# Altium project pca63519.PrjPCB
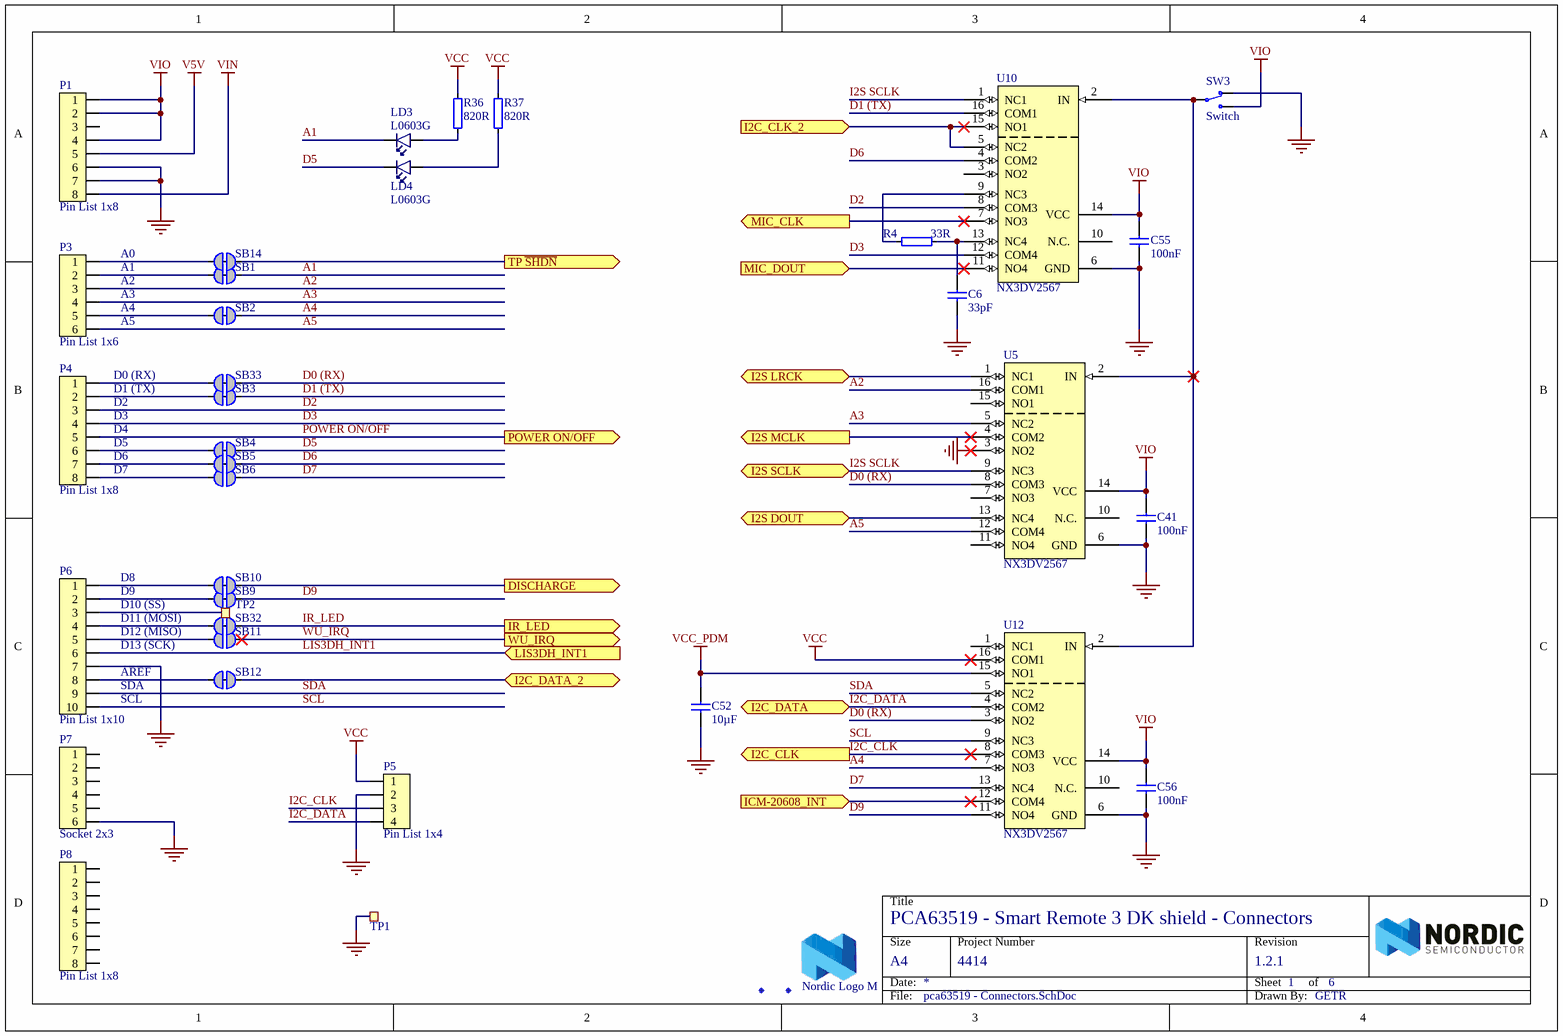
[diagram p0: pca63519 - Connectors.SchDoc]
3 sheets, 120 parts. Net scope: flat (ports and power ports of the same name join across sheets).
Board file: 400129.PcbDoc
Sheets:
  pca63519 - Connectors.SchDoc
  pca63519 - Keyboard.SchDoc
  pca63519 - TouchPad.SchDoc

## Sheet pca63519 - Connectors.SchDoc: PCA63519 - Smart Remote 3 DK shield - Connectors
size A4; DocumentNumber: 1; Revision: 1.2.1; SheetNumber: 1; SheetTotal: 6; DrawnBy: GETR; ProjectNumber: 4414; DocumentSize: A4; PCBRevision: 0049GETR; PCAName: PCA63519; PCBNumber: 400129

### Parts
C6  33pF  [CAPC1005X04L]
C41  100nF  [CAPC1005X04L]
C52  10µF  [CAPC1005X04L]
C55  100nF  [CAPC1005X04L]
C56  100nF  [CAPC1005X04L]
Fid1  Fiducial mark  [Fiducial]  (value not drawn)
Fid2  Fiducial mark  [Fiducial]  (value not drawn)
LD3  L0603G  [LED_0603_G]
LD4  L0603G  [LED_0603_G]
LOGO1  Nordic Logo M  [NORDIC_LOGO_M]  (no BOM)
P1  Pin List 1x8  [LIST_1x8_SMD]
P3  Pin List 1x6  [LIST_1x6_SMD]
P4  Pin List 1x8  [LIST_1x8_SMD]
P5  Pin List 1x4  [LIST_1x4]
P6  Pin List 1x10  [LIST_1x10_SMD]
P7  Socket 2x3  [SOCKET_2x3_SMD-2.54mm-bottom]
P8  Pin List 1x8  [LIST_1x8_SMD]
R4  33R  [RESC1005X04L]
R36  820R  [RESC1005X04L]
R37  820R  [RESC1005X04L]
SB1  Solderbridge  [Solderbridge_SHORTED_0.4]  (value not drawn)  (net tie, no BOM)
SB2  Solderbridge  [Solderbridge_SHORTED_0.4]  (value not drawn)  (net tie, no BOM)
SB3  Solderbridge  [Solderbridge_SHORTED_0.4]  (value not drawn)  (net tie, no BOM)
SB4  Solderbridge  [Solderbridge_SHORTED_0.4]  (value not drawn)  (net tie, no BOM)
SB5  Solderbridge  [Solderbridge_SHORTED_0.4]  (value not drawn)  (net tie, no BOM)
SB6  Solderbridge  [Solderbridge_0.4]  (value not drawn)  (no BOM)
SB9  Solderbridge  [Solderbridge_SHORTED_0.4]  (value not drawn)  (net tie, no BOM)
SB10  Solderbridge  [Solderbridge_SHORTED_0.4]  (value not drawn)  (net tie, no BOM)
SB11  Solderbridge  [Solderbridge_0.4]  (value not drawn)  (no BOM)
SB12  Solderbridge  [Solderbridge_SHORTED_0.4]  (value not drawn)  (net tie, no BOM)
SB14  Solderbridge  [Solderbridge_SHORTED_0.4]  (value not drawn)  (net tie, no BOM)
SB32  Solderbridge  [Solderbridge_SHORTED_0.4]  (value not drawn)  (net tie, no BOM)
SB33  Solderbridge  [Solderbridge_SHORTED_0.4]  (value not drawn)  (net tie, no BOM)
SW3  Switch  [CJS-120xA]
TP1  Ø1.0mm,SMD  [TP_SMD_Ø1.0mm]  (value not drawn)  (no BOM)
TP2  Ø1.0mm,SMD  [TP_SMD_Ø1.0mm]  (value not drawn)  (no BOM)
U5  NX3DV2567  [XQFN40P180X260X50-16N]
U10  NX3DV2567  [XQFN40P180X260X50-16N]
U12  NX3DV2567  [XQFN40P180X260X50-16N]

### Ports
DISCHARGE (out), I2C_CLK (out), I2C_CLK_2 (in), I2C_DATA (bidir), I2C_DATA_2 (bidir), I2S DOUT (bidir), I2S LRCK (bidir), I2S MCLK (out), I2S SCLK (bidir), ICM-20608_INT (in), IR_LED (out), LIS3DH_INT1 (in), MIC_CLK (out), MIC_DOUT (in), POWER ON/OFF (out), TP ~{SHDN} (out), WU_IRQ (out)

### Nets
GND: C6.1 C41.1 C52.1 C55.1 C56.1 P1.6 P1.7 P5.2 P6.7 P7.6 SW3.1(N.C) TP1.1 U5.3(NO2) U5.6(GND) U10.6(GND) U12.6(GND)
V5V: P1.5
VCC: P5.1 R36.2 R37.2 U12.16(COM1)
VCC_PDM: C52.2 U12.15(NO1)
VIN: P1.8
VIO: C41.2 C55.2 C56.2 P1.1 P1.2 P1.4 SW3.3(N.O) U5.14(VCC) U10.14(VCC) U12.14(VCC)
A1: LD3.1(C) SB1.1
A2: P3.3 U5.16(COM1)
A3: P3.4 U5.5(NC2)
A4: SB2.1 U12.7(NO3)
A5: P3.6 U5.12(COM4)
D0 (RX): SB33.1 U5.8(COM3) U12.3(NO2)
D1 (TX): SB3.1 U10.16(COM1)
D2: P4.3 U10.8(COM3)
D3: P4.4 U10.12(COM4)
D5: LD4.1(C) SB4.1
D6: SB5.1 U10.4(COM2)
D7: SB6.1 U12.13(NC4)
D9: SB9.1 U12.11(NO4)
I2C_CLK: P5.3 U12.8(COM3) ; port I2C_CLK
I2C_DATA: P5.4 U12.4(COM2) ; port I2C_DATA
I2S SCLK: U5.9(NC3) U10.1(NC1) ; port I2S SCLK
IR_LED: SB32.1 ; port IR_LED
LIS3DH_INT1: P6.6 ; port LIS3DH_INT1
POWER ON/OFF: P4.5 ; port POWER ON/OFF
SCL: P6.10 U12.9(NC3)
SDA: P6.9 U12.5(NC2)
WU_IRQ: SB11.1 ; port WU_IRQ
NetC6_2: C6.2 R4.2 U10.13(NC4)
NetLD3_2: LD3.2(A) R36.1
NetLD4_2: LD4.2(A) R37.1
NetP3_1: P3.1 SB14.2
NetP3_2: P3.2 SB1.2
NetP3_5: P3.5 SB2.2
NetP4_1: P4.1 SB33.2
NetP4_2: P4.2 SB3.2
NetP4_6: P4.6 SB4.2
NetP4_7: P4.7 SB5.2
NetP4_8: P4.8 SB6.2
NetP6_1: P6.1 SB10.2
NetP6_2: P6.2 SB9.2
NetP6_3: P6.3 TP2.1
NetP6_4: P6.4 SB32.2
NetP6_5: P6.5 SB11.2
NetP6_8: P6.8 SB12.2
NetQ1_1: SB10.1 ; port DISCHARGE
NetR4_1: R4.1 U10.9(NC3)
NetR25_1: SB14.1 ; port TP ~{SHDN}
NetSB12_1: SB12.1 ; port I2C_DATA_2
NetSW3_2: SW3.2(COM) U5.2(IN) U10.2(IN) U12.2(IN)
NetU5_1: U5.1(NC1) ; port I2S LRCK
NetU5_4: U5.4(COM2) ; port I2S MCLK
NetU5_13: U5.13(NC4) ; port I2S DOUT
NetU10_5: U10.5(NC2) U10.15(NO1) ; port I2C_CLK_2
NetU10_7: U10.7(NO3) ; port MIC_CLK
NetU10_11: U10.11(NO4) ; port MIC_DOUT
NetU12_12: U12.12(COM4) ; port ICM-20608_INT

Not connected (* = marked no-connect by the designer): P1 3; P7 1 2 3 4 5; P8 1 2 3 4 5 6 7 8; U5 7(NO3) 10(N.C.) 11(NO4) 15(NO1); U10 3(NO2) 10(N.C.); U12 1(NC1) 10(N.C.)

### Notes on the sheet
- (near P3) A0
- (near P3) A1
- (near P3) A2
- (near P3) A3
- (near P3) A4
- (near P4) D0 (RX)
- (near P3) A5
- (near P4) D1 (TX)
- (near P4) D2
- (near P4) D3
- (near P4) D4
- (near P4) D5
- (near P4) D6
- (near P4) D7
- (near P6) D8
- (near P6) D9
- D10 (SS)
- D11 (MOSI)
- D12 (MISO)
- D13 (SCK)
- (near P6) AREF
- (near P6) SDA
- (near P6) SCL
- Title
- Size
- Date:
- Project Number
- Sheet         of
- Revision
- File:
- Drawn By:

### Library data of the parts
C6 = C0402-33p: Capacitor, NP0, ±5%; Note: 50V; Artikkelnr Noca: 20029146; Artikkelnr Simpro: N.A.; Part Number: C0402-33p; Manufacturer: *; Manufacturer Part Number: *; Datasheet: *; Footprint Doc: 0402; LatestRevisionDate: 2009-05-08; Pin Count: 2; Publisher: Nordic Semiconductor; Published: 2009-05-08; Value: 33pF; Supplier: *; Supplier part number: *; 2nd source Supplier: *; 2nd source part number: *
C41 C55 C56 = C0402-100n: Capacitor, X7R, ±10%; Note: 16V; Artikkelnr Noca: 20039200; Artikkelnr Simpro: N.A.; Part Number: C0402-100n; Manufacturer: *; Manufacturer Part Number: *; Datasheet: *; Footprint Doc: 0402; LatestRevisionDate: 2009-11-23; Pin Count: 2; Publisher: Nordic Semiconductor; Published: 2009-05-08; Value: 100nF; Supplier: *; Supplier part number: *; 2nd source Supplier: *; 2nd source part number: *
C52 = C0402-10µF: 10µF ±20% 10V X5R Ceramic Capacitor -55°C ~ 85°C Surface Mount, MLCC 0402; Manufacturer: Samsung; Manufacturer Part Number: CL05A106MP5NUNC; Artikkelnr Noca: N.A.; Part Number: C0402-10µF; Datasheet: http://www.samsungsem.com/kr/support/product-search/mlcc/CL05A106MP5NUNC.jsp; Footprint Doc: 0402; LatestRevisionDate: 2016-04-19; Pin Count: 2; Publisher: Nordic Semiconductor; Published: 2011-01-17; Value: 10µF; Note: 10V; Supplier: Digi-Key; Supplier part number: 1276-1450-1-ND; 2nd source Supplier: *; 2nd source part number: *; Artikkelnr Simpro: N.A.
Fid1 Fid2 = Fid-Mark: Artikkelnr Noca: N.A.; Part Number: Fid-Mark; Manufacturer: *; Manufacturer Part Number: *; Datasheet: *; LatestRevisionDate: 2009-12-12; Pin Count: 1; Publisher: Nordic Semiconductor; Published: 2009-12-12; Value: *; Note: *; Supplier: *; Supplier part number: *; 2nd source Supplier: *; 2nd source part number: *; Footprint Doc: Fiducial; Artikkelnr Simpro: N.A.
LD3 LD4 = LG L29K Smartled Green: LED SMARTLED GREEN 570NM 0603; Manufacturer: Osram; Manufacturer Part Number: LG L29K-G2J1-24-Z; 2nd source part number: 720-LGL29KG2J124Z; Note: 2,24..5.6 mcd, Vfmin=1.7V; Artikkelnr Noca: 13019147; Artikkelnr Simpro: N.A.; Part Number: LG L29K Smartled Green; Datasheet: http://www.osram-os.com/Graphics/XPic2/00077107_0.pdf; Footprint Doc: 0603; LatestRevisionDate: 2016-08-26; Pin Count: 2; Publisher: Nordic Semiconductor; Published: 2014-10-28; Value: L0603G; Supplier: Digi-Key; Supplier part number: 475-2709-1-ND; 2nd source Supplier: Mouser
LOGO1 = Nordic Logo M: Nordic Logo, medium size; Artikkelnr Noca: N.A.; Part Number: Nordic Logo M; Manufacturer: *; Manufacturer Part Number: *; Datasheet: *; LatestRevisionDate: 2010-02-18; Publisher: Nordic Semiconductor; Value: Nordic Logo M; Note: *; Supplier: *; Supplier part number: *; 2nd source Supplier: *; 2nd source part number: *; Pin Count: 2; Published: 2010-02-18; Footprint Doc: NORDIC_LOGO_M; Artikkelnr Simpro: N.A.
P1 P4 P8 = Pin List 1x8 SMD: Pin List 1x8, 2.54mm (100mil), SMD; Manufacturer: W-CON; Manufacturer Part Number: 1125-1108S0M116R2; 2nd source part number: TSM-108-01-L-SV-P-TR; Artikkelnr Noca: 55010006; Artikkelnr Simpro: N.A.; Part Number: Pin List 1x8 SMD; Datasheet: \\hizz\pro\app9717\Datasheet\connectores\W-CON\1125-11XXXXMXXXXX.pdf; LatestRevisionDate: 2016-01-22; Publisher: Nordic Semiconductor; Published: 2016-01-22; Value: Pin List 1x8; Note: *; Supplier: Cabcon; Supplier part number: 1125-1108S0M116R2; 2nd source Supplier: Samtec; Pin Count: 8; Footprint Doc: LIST_1x8_SMD
P3 = Pin List 1x6 SMD: Pin List 1x6, 2.54mm (100mil), SMD; Manufacturer: W-CON; Manufacturer Part Number: 1125-1106S0M116R2; 2nd source part number: TSM-106-01-L-SV-P-TR; Artikkelnr Noca: 55010026; Artikkelnr Simpro: N.A.; Part Number: Pin List 1x6 SMD; Datasheet: \\hizz\pro\app9717\Datasheet\connectores\W-CON\1125-11XXXXMXXXXX.pdf; LatestRevisionDate: 2016-03-29; Pin Count: 6; Publisher: Nordic Semiconductor; Published: 2016-03-29; Value: Pin List 1x6; Note: *; Supplier: Cabcon; Supplier part number: 1125-1106S0M116R2; 2nd source Supplier: Samtec; Footprint Doc: LIST_1x6_SMD
P5 = Pin List 1x4: Pin List 1x4, 2.54mm (100mil); Artikkelnr Noca: 56019092; Artikkelnr Simpro: N.A.; Part Number: Pin List 1x4; Manufacturer: *; Manufacturer Part Number: *; Datasheet: *; Footprint Doc: LIST_1x4; LatestRevisionDate: 2009-12-12; Pin Count: 4; Publisher: Nordic Semiconductor; Published: 2009-12-12; Value: Pin List 1x4; Note: *; Supplier: *; Supplier part number: *; 2nd source Supplier: *; 2nd source part number: *
P6 = Pin List 1x10 SMD: Pin List 1x10, 2.54mm (100mil), SMD; Manufacturer: W-CON; Manufacturer Part Number: 1125-1110S0M116R2; 2nd source part number: TSM-110-01-L-SV-P-TR; Artikkelnr Noca: 55010028; Artikkelnr Simpro: N.A.; Part Number: Pin List 1x10 SMD; Datasheet: \\hizz\pro\app9717\Datasheet\connectores\W-CON\1125-11XXXXMXXXXX.pdf; LatestRevisionDate: 2016-03-29; Publisher: Nordic Semiconductor; Published: 2016-03-29; Value: Pin List 1x10; Note: *; Supplier: Cabcon; Supplier part number: 1125-1110S0M116R2; 2nd source Supplier: Samtec; Pin Count: 10; Footprint Doc: LIST_1x10_SMD
P7 = Socket 2x3 SMD Bottom: Socket 2x3, 2.54mm (100mil), SMD; Manufacturer: W-CON; Manufacturer Part Number: 2171-203MS0CUNR1; 2nd source part number: SSM-103-F-DV-P-TR; Artikkelnr Noca: 55030010; Artikkelnr Simpro: N.A.; Part Number: Socket 2x3 SMD Bottom; Datasheet: \\hizz\pro\app9717\Datasheet\connectores\W-CON\2171-2XXMXXCUNXX.pdf; LatestRevisionDate: 2016-03-29; Pin Count: 6; Publisher: Nordic Semiconductor; Published: 2014-06-10; Value: Socket 2x3; Note: *; Supplier: Cabcon; Supplier part number: 2171-203MS0CUNR1; 2nd source Supplier: Samtec; Footprint Doc: SOCKET_2x3_SMD-2.54mm-bottom
R4 = R0402-33R: Resistor, ±1%, 0.063W; Note: Chip Res 1%; Artikkelnr Noca: 27049037; Artikkelnr Simpro: N.A.; Value Ohm: 33; Part Number: R0402-33R; Manufacturer: *; Manufacturer Part Number: *; Datasheet: *; Footprint Doc: 0402; LatestRevisionDate: 2009-11-23; Pin Count: 2; Publisher: Nordic Semiconductor; Published: 2009-05-08; Value: 33R; Supplier: Farnell; Supplier part number: 173-8830; 2nd source Supplier: *; 2nd source part number: *
R36 R37 = R0402-820: Resistor, ±1%, 0.063W; Note: Chip Res 1%; Artikkelnr Noca: 27049071; Artikkelnr Simpro: N.A.; Value Ohm: 820; Part Number: R0402-820; Manufacturer: *; Manufacturer Part Number: *; Datasheet: *; Footprint Doc: 0402; LatestRevisionDate: 2009-11-23; Pin Count: 2; Publisher: Nordic Semiconductor; Published: 2009-05-08; Value: 820R; Supplier: Farnell; Supplier part number: 173-8849; 2nd source Supplier: *; 2nd source part number: *
SB1-SB5 SB9 SB10 SB12 SB14 SB32 SB33 = Solderbridge Shorted 0.4mm: Shorted Solderbridge; Artikkelnr Noca: N.A.; Part Number: Solderbridge Shorted 0.4mm; Manufacturer: *; Manufacturer Part Number: *; Datasheet: *; Footprint Doc: Solderbridge_Shorted; LatestRevisionDate: 2012-08-07; Pin Count: 2; Publisher: Nordic Semiconductor; Published: 2012-08-07; Value: Solderbridge; Note: *; Supplier: *; Supplier part number: *; 2nd source Supplier: *; 2nd source part number: *; Artikkelnr Simpro: N.A.
SB6 SB11 = Solderbridge 0.4mm: Artikkelnr Noca: N.A.; Part Number: Solderbridge 0.4mm; Manufacturer: *; Manufacturer Part Number: *; Datasheet: *; Footprint Doc: Solderbridge; LatestRevisionDate: 2009-12-14; Pin Count: 2; Publisher: Nordic Semiconductor; Published: 2009-12-14; Value: Solderbridge; Note: *; Supplier: *; Supplier part number: *; 2nd source Supplier: *; 2nd source part number: *; Artikkelnr Simpro: N.A.
SW3 = CJS-1200TA: SMD slide Switch (ON-ON); Manufacturer: Copal Electronics Inc; Artikkelnr Noca: 50019068; Artikkelnr Simpro: N.A.; Part Number: CJS-1200TA; Manufacturer Part Number: CJS-1200TA; Datasheet: http://media.digikey.com/pdf/Data%20Sheets/COPAL%20Electronics%20PDFs/CJS.pdf; LatestRevisionDate: 2012-10-03; Pin Count: 3; Publisher: Nordic Semiconductor; Published: 2012-10-03; Value: Switch; Note: *; Supplier: Digi-Key; Supplier part number: 563-1021-2-ND; 2nd source Supplier: *; 2nd source part number: *; Footprint Doc: CJS-120xA
TP1 TP2 = TP_SMD_Ø1.0MM: 1.0mm circular SMD testpad; Manufacturer: Nordic Semiconductor; Artikkelnr Noca: N.A.; Part Number: TP_SMD_Ø1.0MM; Manufacturer Part Number: *; Datasheet: *; Footprint Doc: TP_SMD_Ø1.0mm; LatestRevisionDate: 2013-06-11; Pin Count: 1; Publisher: Nordic Semiconductor; Published: 2013-06-11; Value: Ø1.0mm,SMD; Note: *; Supplier: *; Supplier part number: *; 2nd source Supplier: *; 2nd source part number: *; Artikkelnr Simpro: N.A.
U5 U10 U12 = NX3DV2567GU: Low-ohmic four-pole double-throw analog switch; Manufacturer: NXP Semiconductors; 2nd source part number: 771-NX3DV2567GU115; Artikkelnr Noca: 15079317; Artikkelnr Simpro: N.A.; Part Number: NX3DV2567GU; Manufacturer Part Number: NX3DV2567GU; Datasheet: http://www.nxp.com/documents/data_sheet/NX3DV2567.pdf; Footprint Doc: XQFN-16; LatestRevisionDate: 2015-02-17; Pin Count: 16; Publisher: Nordic Semiconductor; Published: 2015-02-17; Value: NX3DV2567; Note: *; Supplier: Digi-Key; Supplier part number: 568-5206-1-ND; 2nd source Supplier: Mouser

## Sheet pca63519 - Keyboard.SchDoc: PCA63519 - Smart Remote 3 DK shield - Keyboard
size A4; DocumentNumber: 4; Revision: 1.2.1; SheetNumber: 4; SheetTotal: 6; DrawnBy: GETR; ProjectNumber: 4414; DocumentSize: A4; PCBRevision: 0049GETR; PCAName: PCA63519; PCBNumber: 400129
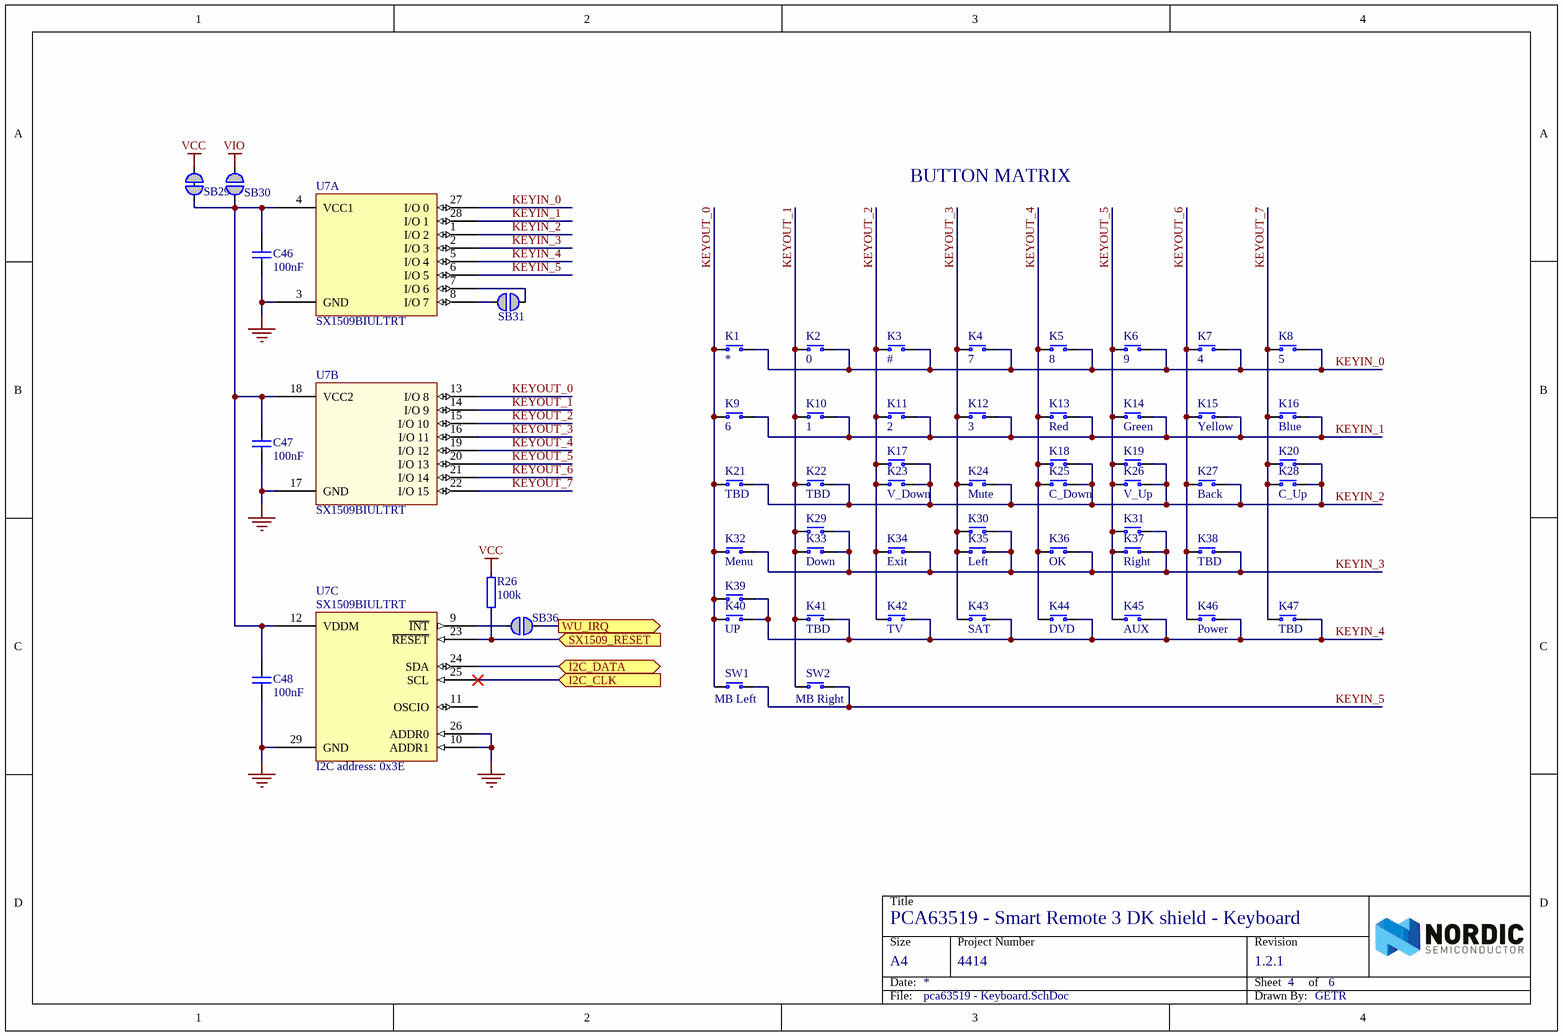
[diagram p1: pca63519 - Keyboard.SchDoc]

### Parts
C46  100nF  [CAPC1005X04L]
C47  100nF  [CAPC1005X04L]
C48  100nF  [CAPC1005X04L]
K1  *  [PCB Switch]  (no BOM)
K2  0  [PCB Switch]  (no BOM)
K3  #  [PCB Switch]  (no BOM)
K4  7  [PCB Switch]  (no BOM)
K5  8  [PCB Switch]  (no BOM)
K6  9  [PCB Switch]  (no BOM)
K7  4  [PCB Switch]  (no BOM)
K8  5  [PCB Switch]  (no BOM)
K9  6  [PCB Switch]  (no BOM)
K10  1  [PCB Switch]  (no BOM)
K11  2  [PCB Switch]  (no BOM)
K12  3  [PCB Switch]  (no BOM)
K13  Red  [PCB Switch]  (no BOM)
K14  Green  [PCB Switch]  (no BOM)
K15  Yellow  [PCB Switch]  (no BOM)
K16  Blue  [PCB Switch]  (no BOM)
K17  PCB SW  [PCB Switch]  (value not drawn)  (no BOM)
K18  PCB SW  [PCB Switch]  (value not drawn)  (no BOM)
K19  PCB SW  [PCB Switch]  (value not drawn)  (no BOM)
K20  PCB SW  [PCB Switch]  (value not drawn)  (no BOM)
K21  TBD  [PCB Switch]  (no BOM)
K22  TBD  [PCB Switch]  (no BOM)
K23  V_Down  [PCB Switch]  (no BOM)
K24  Mute  [PCB Switch]  (no BOM)
K25  C_Down  [PCB Switch]  (no BOM)
K26  V_Up  [PCB Switch]  (no BOM)
K27  Back  [PCB Switch]  (no BOM)
K28  C_Up  [PCB Switch]  (no BOM)
K29  PCB SW  [PCB Switch]  (value not drawn)  (no BOM)
K30  PCB SW  [PCB Switch]  (value not drawn)  (no BOM)
K31  PCB SW  [PCB Switch]  (value not drawn)  (no BOM)
K32  Menu  [PCB Switch]  (no BOM)
K33  Down  [PCB Switch]  (no BOM)
K34  Exit  [PCB Switch]  (no BOM)
K35  Left  [PCB Switch]  (no BOM)
K36  OK  [PCB Switch]  (no BOM)
K37  Right  [PCB Switch]  (no BOM)
K38  TBD  [PCB Switch]  (no BOM)
K39  PCB SW  [PCB Switch]  (value not drawn)  (no BOM)
K40  UP  [PCB Switch]  (no BOM)
K41  TBD  [PCB Switch]  (no BOM)
K42  TV  [PCB Switch]  (no BOM)
K43  SAT  [PCB Switch]  (no BOM)
K44  DVD  [PCB Switch]  (no BOM)
K45  AUX  [PCB Switch]  (no BOM)
K46  Power  [PCB Switch]  (no BOM)
K47  TBD  [PCB Switch]  (no BOM)
R26  100k  [RESC1005X04L]
SB29  Solderbridge  [Solderbridge_SHORTED_0.4]  (value not drawn)  (net tie, no BOM)
SB30  Solderbridge  [Solderbridge_0.4]  (value not drawn)  (no BOM)
SB31  Solderbridge  [Solderbridge_0.4]  (value not drawn)  (no BOM)
SB36  Solderbridge  [Solderbridge_0.4]  (value not drawn)  (no BOM)
SW1  MB Left  [ALPS_SKHUxxx010_WO_GND]
SW2  MB Right  [ALPS_SKHUxxx010_WO_GND]
U7  SX1509BIULTRT  [QFN40P400X400X60_HS-29N]  (parts A,B,C of 3)

### Ports
I2C_CLK (in), I2C_DATA (bidir), SX1509_RESET (in), WU_IRQ (out)

### Nets
GND: C46.1 C47.1 C48.1 U7.3(GND) U7.10(ADDR1) U7.17(GND) U7.26(ADDR0) U7.29(GND)
VCC: R26.2 SB29.1
VIO: SB30.1
I2C_CLK: U7.25(SCL) ; port I2C_CLK
I2C_DATA: U7.24(SDA) ; port I2C_DATA
KEYIN_0: K1.1(N.O) K2.1(N.O) K3.1(N.O) K4.1(N.O) K5.1(N.O) K6.1(N.O) K7.1(N.O) K8.1(N.O) U7.27(I/O_0)
KEYIN_1: K9.1(N.O) K10.1(N.O) K11.1(N.O) K12.1(N.O) K13.1(N.O) K14.1(N.O) K15.1(N.O) K16.1(N.O) U7.28(I/O_1)
KEYIN_2: K17.1(N.O) K18.1(N.O) K19.1(N.O) K20.1(N.O) K21.1(N.O) K22.1(N.O) K23.1(N.O) K24.1(N.O) K25.1(N.O) K26.1(N.O) K27.1(N.O) K28.1(N.O) U7.1(I/O_2)
KEYIN_3: K29.1(N.O) K30.1(N.O) K31.1(N.O) K32.1(N.O) K33.1(N.O) K34.1(N.O) K35.1(N.O) K36.1(N.O) K37.1(N.O) K38.1(N.O) U7.2(I/O_3)
KEYIN_4: K39.1(N.O) K40.1(N.O) K41.1(N.O) K42.1(N.O) K43.1(N.O) K44.1(N.O) K45.1(N.O) K46.1(N.O) K47.1(N.O) U7.5(I/O_4)
KEYIN_5: SW1.1(N.O) SW2.1(N.O) U7.6(I/O_5)
KEYOUT_0: K1.2(COM) K9.2(COM) K21.2(COM) K32.2(COM) K39.2(COM) K40.2(COM) SW1.2(COM) U7.13(I/O_8)
KEYOUT_1: K2.2(COM) K10.2(COM) K22.2(COM) K29.2(COM) K33.2(COM) K41.2(COM) SW2.2(COM) U7.14(I/O_9)
KEYOUT_2: K3.2(COM) K11.2(COM) K17.2(COM) K23.2(COM) K34.2(COM) K42.2(COM) U7.15(I/O_10)
KEYOUT_3: K4.2(COM) K12.2(COM) K24.2(COM) K30.2(COM) K35.2(COM) K43.2(COM) U7.16(I/O_11)
KEYOUT_4: K5.2(COM) K13.2(COM) K18.2(COM) K25.2(COM) K36.2(COM) K44.2(COM) U7.19(I/O_12)
KEYOUT_5: K6.2(COM) K14.2(COM) K19.2(COM) K26.2(COM) K31.2(COM) K37.2(COM) K45.2(COM) U7.20(I/O_13)
KEYOUT_6: K7.2(COM) K15.2(COM) K27.2(COM) K38.2(COM) K46.2(COM) U7.21(I/O_14)
KEYOUT_7: K8.2(COM) K16.2(COM) K20.2(COM) K28.2(COM) K47.2(COM) U7.22(I/O_15)
WU_IRQ: SB36.1 ; port WU_IRQ
NetC46_2: C46.2 C47.2 C48.2 SB29.2 SB30.2 U7.4(VCC1) U7.12(VDDM) U7.18(VCC2)
NetR26_1: R26.1 U7.23(~{RESET}) ; port SX1509_RESET
NetSB31_1: SB31.1 U7.8(I/O_7)
NetSB31_2: SB31.2 U7.7(I/O_6)
NetSB36_2: SB36.2 U7.9(~{INT})

Not connected (* = marked no-connect by the designer): U7 11(OSCIO)

### Notes on the sheet
- BUTTON MATRIX
- (near U7) I2C address: 0x3E
- Title
- Size
- Date:
- Project Number
- Sheet         of
- Revision
- File:
- Drawn By:

### Library data of the parts
C46-C48 = C0402-100n: as C41 on sheet pca63519 - Connectors; Part Number: C0402-100n; Manufacturer: *; Manufacturer Part Number: *; Datasheet: *; LatestRevisionDate: 2009-11-23; Pin Count: 2; Publisher: Nordic Semiconductor; Published: 2009-05-08; Value: 100nF; Supplier: *; Supplier part number: *; 2nd source Supplier: *; 2nd source part number: *; Footprint Doc: 0402
K1-K16 K21-K28 K32-K38 K40-K47 = KEY_SWITCH_SR3: Keyboard matrix switch; Value: PCB SW; Artikkelnr Noca: N.A.; Part Number: KEY_SWITCH_SR3; Manufacturer: *; Manufacturer Part Number: *; Datasheet: *; LatestRevisionDate: 2015-05-05; Pin Count: 2; Publisher: Nordic Semiconductor; Published: 2015-05-05; Note: *; Supplier: *; Supplier part number: *; 2nd source Supplier: *; 2nd source part number: *; Footprint Doc: *; Artikkelnr Simpro: N.A.
K17-K20 K29-K31 K39 = KEY_SWITCH_SR3: Keyboard matrix switch; Artikkelnr Noca: N.A.; Part Number: KEY_SWITCH_SR3; Manufacturer: *; Manufacturer Part Number: *; Datasheet: *; LatestRevisionDate: 2015-05-05; Pin Count: 2; Publisher: Nordic Semiconductor; Published: 2015-05-05; Value: PCB SW; Note: *; Supplier: *; Supplier part number: *; 2nd source Supplier: *; 2nd source part number: *; Footprint Doc: *; Artikkelnr Simpro: N.A.
R26 = R0402-100k: Resistor, ±1%, 0.063W; Note: Chip Res 1%; Artikkelnr Noca: 27049121; Artikkelnr Simpro: N.A.; Value Ohm: 100000; Part Number: R0402-100k; Manufacturer: *; Manufacturer Part Number: *; Datasheet: *; Footprint Doc: 0402; LatestRevisionDate: 2009-11-23; Pin Count: 2; Publisher: Nordic Semiconductor; Published: 2009-05-08; Value: 100k; Supplier: Farnell; Supplier part number: 173-8877; 2nd source Supplier: *; 2nd source part number: *
SB29 = Solderbridge Shorted 0.4mm: as SB1 on sheet pca63519 - Connectors; Part Number: Solderbridge Shorted 0.4mm; Manufacturer: *; Manufacturer Part Number: *; Datasheet: *; Footprint Doc: Solderbridge_Shorted; LatestRevisionDate: 2012-08-07; Pin Count: 2; Publisher: Nordic Semiconductor; Published: 2012-08-07; Value: Solderbridge; Note: *; Supplier: *; Supplier part number: *; 2nd source Supplier: *; 2nd source part number: *; Artikkelnr Simpro: N.A.
SB30 SB31 SB36 = Solderbridge 0.4mm: Artikkelnr Noca: N.A.; Part Number: Solderbridge 0.4mm; Manufacturer: *; Manufacturer Part Number: *; Datasheet: *; Footprint Doc: Solderbridge; LatestRevisionDate: 2009-12-14; Pin Count: 2; Publisher: Nordic Semiconductor; Published: 2009-12-14; Value: Solderbridge; Note: *; Supplier: *; Supplier part number: *; 2nd source Supplier: *; 2nd source part number: *; Artikkelnr Simpro: N.A.
SW1 SW2 = ALPS_SKHUALE010: ALPS - SKHUALE010 - Tactile Switch, SPNO, SMD, 6.5x6.2x2.5mm; 2nd source part number: 688-SKHUALE010; Value: PB SW; Artikkelnr Noca: 50019001; Artikkelnr Simpro: N.A.; Part Number: ALPS_SKHUALE010; Manufacturer: Alps; Manufacturer Part Number: SKHUALE010; Datasheet: https://www1.elfa.se/data1/wwwroot/webroot/Z_DATA/03579000.pdf; LatestRevisionDate: 2010-02-01; Pin Count: 4; Publisher: Nordic Semiconductor; Published: 2010-02-01; Note: *; Supplier: Elfa; Supplier part number: 35-790-00; 2nd source Supplier: Mouser; Footprint Doc: ALPS_SKHUxxx010_WO_GND
U7 = SX1509BIULTRT: IC GPIO EXPANDER I2C 16CH 28QFN; Manufacturer: Semtech Corporation; Artikkelnr Noca: N.A.; Part Number: SX1509BIULTRT; Manufacturer Part Number: SX1509BIULTRT; Datasheet: http://www.semtech.com/apps/product.php?pn=sx1509&x=0&y=0; Footprint Doc: QFN-28; LatestRevisionDate: 2015-03-10; Pin Count: 29; Publisher: Nordic Semiconductor; Published: 2015-03-10; Value: SX1509BIULTRT; Note: *; Supplier: Digi-Key; Supplier part number: SX1509BIULCT-ND; 2nd source Supplier: *; 2nd source part number: *; Artikkelnr Simpro: N.A.

## Sheet pca63519 - TouchPad.SchDoc: PCA63519 - Smart Remote 3 DK shield - Touch Pad
size A4; DocumentNumber: 6; Revision: 1.2.1; SheetNumber: 6; SheetTotal: 6; DrawnBy: GETR; ProjectNumber: 4414; DocumentSize: A4; PCBRevision: 0049GETR; PCAName: PCA63519; PCBNumber: 400129
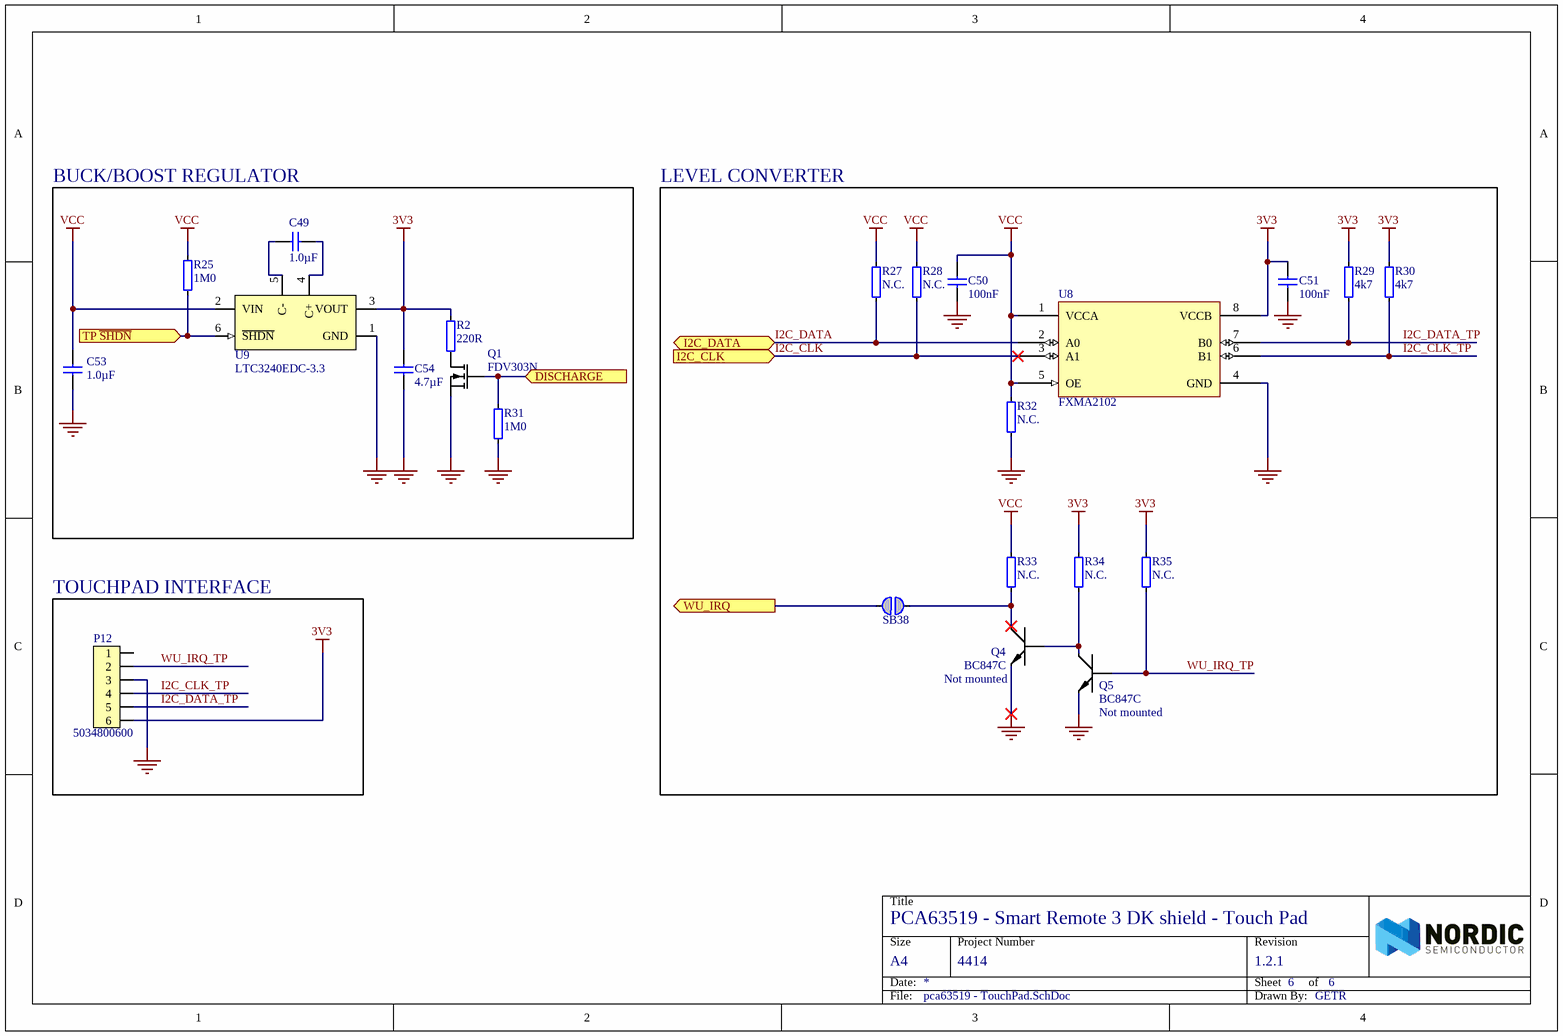
[diagram p2: pca63519 - TouchPad.SchDoc]

### Parts
C49  1.0µF  [CAPC1005X04L]
C50  100nF  [CAPC1005X04L]
C51  100nF  [CAPC1005X04L]
C53  1.0µF  [CAPC1005X04L]
C54  4.7µF  [CAPC1005X04L]
P12  5034800600  [Molex 5034800600]
Q1  FDV303N  [SOT-23a]
Q4  BC847C  Assembly: Not mounted  [SOT-23a]
Q5  BC847C  Assembly: Not mounted  [SOT-23a]
R2  220R  [RESC1005X04L]
R25  1M0  [RESC1005X04L]
R27  N.C.  [RESC1005X04L]
R28  N.C.  [RESC1005X04L]
R29  4k7  [RESC1005X04L]
R30  4k7  [RESC1005X04L]
R31  1M0  [RESC1005X04L]
R32  N.C.  [RESC1005X04L]
R33  N.C.  [RESC1005X04L]
R34  N.C.  [RESC1005X04L]
R35  N.C.  [RESC1005X04L]
SB38  Solderbridge  [Solderbridge_0.4]  (value not drawn)  (no BOM)
U8  FXMA2102  [QFN40P140X120X55-8N]
U9  LTC3240EDC-3.3  [SON50P200X80_HS-7N]

### Blocks framed on the sheet
BUCK/BOOST REGULATOR: C49 C53 C54 Q1 R2 R25 R31 U9
LEVEL CONVERTER: C50 C51 Q4 Q5 R27-R30 R32-R35 SB38 U8
TOUCHPAD INTERFACE: P12

### Ports
DISCHARGE (in), I2C_CLK (in), I2C_DATA (bidir), TP ~{SHDN} (in), WU_IRQ (out)

### Nets
3V3: C51.2 C54.2 P12.6 R2.2 R29.1 R30.1 R34.1 R35.1 U8.8(VCCB) U9.3(VOUT)
GND: C50.1 C51.1 C53.1 C54.1 P12.3 Q1.2(S) Q4.2(E) Q5.2(E) R31.1 R32.2 U8.4(GND) U9.1(GND) U9.7(GND)
VCC: C50.2 C53.2 R25.2 R27.1 R28.1 R32.1 R33.1 U8.1(VCCA) U8.5(OE) U9.2(VIN)
I2C_CLK: R28.2 U8.3(A1) ; port I2C_CLK
I2C_CLK_TP: P12.4 R30.2 U8.6(B1)
I2C_DATA: R27.2 U8.2(A0) ; port I2C_DATA
I2C_DATA_TP: P12.5 R29.2 U8.7(B0)
WU_IRQ: SB38.2 ; port WU_IRQ
WU_IRQ_TP: P12.2 Q5.1(B) R35.2
NetC49_1: C49.1 U9.4(C+)
NetC49_2: C49.2 U9.5(C-)
NetQ1_1: Q1.1(G) R31.2 ; port DISCHARGE
NetQ1_3: Q1.3(D) R2.1
NetQ4_1: Q4.1(B) Q5.3(C) R34.2
NetQ4_3: Q4.3(C) R33.2 SB38.1
NetR25_1: R25.1 U9.6(~{SHDN}) ; port TP ~{SHDN}

Not connected (* = marked no-connect by the designer): P12 1

### Notes on the sheet
- Title
- Size
- Date:
- Project Number
- Sheet         of
- Revision
- File:
- Drawn By:

### Library data of the parts
C49 C53 = C0402-1µ0: Capacitor, X5R, ±5%; Note: 6.3V; Artikkelnr Noca: 20039235; Artikkelnr Simpro: N.A.; Part Number: C0402-1µ0; Manufacturer: *; Manufacturer Part Number: *; Datasheet: *; Footprint Doc: 0402; LatestRevisionDate: 2016-08-22; Pin Count: 2; Publisher: Nordic Semiconductor; Published: 2009-05-08; Value: 1.0µF; Supplier: Digi-Key; Supplier part number: 1276-1444-1-ND; 2nd source Supplier: *; 2nd source part number: *
C50 C51 = C0402-100n: as C41 on sheet pca63519 - Connectors; Part Number: C0402-100n; Manufacturer: *; Manufacturer Part Number: *; Datasheet: *; Footprint Doc: 0402; LatestRevisionDate: 2009-11-23; Pin Count: 2; Publisher: Nordic Semiconductor; Published: 2009-05-08; Value: 100nF; Supplier: *; Supplier part number: *; 2nd source Supplier: *; 2nd source part number: *
C54 = C0402-4µ7: Capacitor, X5R, ±20%; Note: 10V; Artikkelnr Noca: 20039482; Artikkelnr Simpro: N.A.; Part Number: C0402-4µ7; Manufacturer: *; Manufacturer Part Number: *; Datasheet: *; Footprint Doc: 0402; LatestRevisionDate: 2016-08-22; Pin Count: 2; Publisher: Nordic Semiconductor; Published: 2009-05-08; Value: 4.7µF; Supplier: Digi-Key; Supplier part number: 490-13252-1-ND; 2nd source Supplier: *; 2nd source part number: *
P12 = Molex 5034800600: CONN FFC FPC 6POS 0.50MM R/A; Manufacturer: Molex; Artikkelnr Noca: N.A.; Part Number: Molex 5034800600; Manufacturer Part Number: 5034800600; Datasheet: http://www.molex.com/pdm_docs/sd/5034800600_sd.pdf; Footprint Doc: Molex 5034800600; LatestRevisionDate: 2015-10-01; Pin Count: 8; Publisher: Nordic Semiconductor; Published: 2015-10-01; Value: 5034800600; Note: *; Supplier: Digi-Key; Supplier part number: WM1387TR-ND; 2nd source Supplier: *; 2nd source part number: *; Artikkelnr Simpro: N.A.
Q1 = FDV303N: Mosfet FDV303N; 2nd source part number: FDV303NCT-ND; Note: Schottky; Artikkelnr Noca: 35029048; Artikkelnr Simpro: N.A.; Part Number: FDV303N; Manufacturer: *; Manufacturer Part Number: *; Datasheet: *; Footprint Doc: SOT-23a; LatestRevisionDate: 2009-11-23; Pin Count: 3; Publisher: Nordic Semiconductor; Published: 2009-05-10; Value: FDV303N; Supplier: Farnell; Supplier part number: 984-5020; 2nd source Supplier: Digi-Key
Q4 Q5 = BC847C: BC847C, NPN Silicon transistor; Manufacturer: NXP; 2nd source part number: 568-1636-1-ND; Note: NPN Epitaxial Silicon Transistor; Artikkelnr Noca: 35019020; Artikkelnr Simpro: N.A.; Part Number: BC847C; Manufacturer Part Number: BC847C; Datasheet: *; Footprint Doc: SOT-23a; LatestRevisionDate: 2009-11-23; Pin Count: 3; Publisher: Nordic Semiconductor; Published: 2009-05-10; Value: BC847C; Supplier: Farnell; Supplier part number: 108-1235; 2nd source Supplier: Digi-Key
R2 = R0402-220: Resistor, ±1%, 0.063W; Note: Chip Res 1%; Artikkelnr Noca: 27049057; Artikkelnr Simpro: N.A.; Value Ohm: 220; Part Number: R0402-220; Manufacturer: *; Manufacturer Part Number: *; Datasheet: *; Footprint Doc: 0402; LatestRevisionDate: 2009-11-23; Pin Count: 2; Publisher: Nordic Semiconductor; Published: 2009-05-08; Value: 220R; Supplier: Farnell; Supplier part number: 173-8841; 2nd source Supplier: *; 2nd source part number: *
R25 R31 = R0402-1M0: Resistor, ±1%, 0.063W; Note: Chip Res 1%; Artikkelnr Noca: 27049145; Artikkelnr Simpro: N.A.; Value Ohm: 1000000; Part Number: R0402-1M0; Manufacturer: *; Manufacturer Part Number: *; Datasheet: *; Footprint Doc: 0402; LatestRevisionDate: 2009-11-23; Pin Count: 2; Publisher: Nordic Semiconductor; Published: 2009-05-08; Value: 1M0; Supplier: *; Supplier part number: *; 2nd source Supplier: *; 2nd source part number: *
R27 R28 R32-R35 = R0402-N.C.: Not mounted; Note: Chip Res; Artikkelnr Noca: N.A.; Assembly: Not mounted; Part Number: R0402-N.C.; Manufacturer: *; Manufacturer Part Number: *; Datasheet: *; LatestRevisionDate: 2009-05-08; Pin Count: 2; Publisher: Nordic Semiconductor; Published: 2009-05-08; Value: N.C.; Supplier: *; Supplier part number: *; 2nd source Supplier: *; 2nd source part number: *; Footprint Doc: 0402; Artikkelnr Simpro: N.A.
R29 R30 = R0402-4k7: Resistor, ±1%, 0.063W; Note: Chip Res 1%; Artikkelnr Noca: 27049089; Artikkelnr Simpro: N.A.; Value Ohm: 4700; Part Number: R0402-4k7; Manufacturer: *; Manufacturer Part Number: *; Datasheet: *; LatestRevisionDate: 2009-11-23; Pin Count: 2; Publisher: Nordic Semiconductor; Published: 2009-05-08; Value: 4k7; Supplier: Farnell; Supplier part number: 173-8858; 2nd source Supplier: *; 2nd source part number: *; Footprint Doc: 0402
SB38 = Solderbridge 0.4mm: Artikkelnr Noca: N.A.; Part Number: Solderbridge 0.4mm; Manufacturer: *; Manufacturer Part Number: *; Datasheet: *; Footprint Doc: Solderbridge; LatestRevisionDate: 2009-12-14; Pin Count: 2; Publisher: Nordic Semiconductor; Published: 2009-12-14; Value: Solderbridge; Note: *; Supplier: *; Supplier part number: *; 2nd source Supplier: *; 2nd source part number: *; Artikkelnr Simpro: N.A.
U8 = FXMA2102: XLATOR/BUFF/REPEAT/ISOLATR 8UMLPd; Manufacturer: Fairchild; Manufacturer Part Number: FXMA2102UMX; Artikkelnr Noca: N.A.; Part Number: FXMA2102; Datasheet: https://www.fairchildsemi.com/products/logic/voltage-level-translators/voltage-level-translators/FXMA2102.html?keyword=FXMA2102; Footprint Doc: UFQFN-8; LatestRevisionDate: 2015-04-29; Pin Count: 8; Publisher: Nordic Semiconductor; Published: 2015-04-29; Value: FXMA2102; Note: *; Supplier: Digi-Key; Supplier part number: FXMA2102UMXCT-ND; 2nd source Supplier: *; 2nd source part number: *; Artikkelnr Simpro: N.A.
U9 = LTC3240EDC-3.3: IC REG MULTI CONFIG 3.3V 6DFN; Manufacturer: Linear Technology; Manufacturer Part Number: LTC3240EDC-3.3#TRMPBF; Artikkelnr Noca: N.A.; Part Number: LTC3240EDC-3.3; Datasheet: http://www.linear.com/docs/14497; Footprint Doc: WFDFN-6; LatestRevisionDate: 2009-04-22; Pin Count: 7; Publisher: Nordic Semiconductor; Published: 2009-04-22; Value: LTC3240EDC-3.3; Note: *; Supplier: Digi-Key; Supplier part number: LTC3240EDC-3.3#TRMPBFCT-ND; 2nd source Supplier: *; 2nd source part number: *; Artikkelnr Simpro: N.A.

## Nets that join several sheets
GND: pca63519 - Connectors (16 pins), pca63519 - Keyboard (8 pins), pca63519 - TouchPad (13 pins)
VCC: pca63519 - Connectors (P5.1 R36.2 R37.2 U12.16), pca63519 - Keyboard (R26.2 SB29.1), pca63519 - TouchPad (10 pins)
VIO: pca63519 - Connectors (10 pins), pca63519 - Keyboard (SB30.1)
I2C_CLK: pca63519 - Connectors (P5.3 U12.8), pca63519 - Keyboard (U7.25), pca63519 - TouchPad (R28.2 U8.3)
I2C_DATA: pca63519 - Connectors (P5.4 U12.4), pca63519 - Keyboard (U7.24), pca63519 - TouchPad (R27.2 U8.2)
NetQ1_1: pca63519 - Connectors (SB10.1), pca63519 - TouchPad (Q1.1 R31.2)
NetR25_1: pca63519 - Connectors (SB14.1), pca63519 - TouchPad (R25.1 U9.6)
WU_IRQ: pca63519 - Connectors (SB11.1), pca63519 - Keyboard (SB36.1), pca63519 - TouchPad (SB38.2)